# EAGLE design Control_Board_V2 (EAGLE 9.5.2)
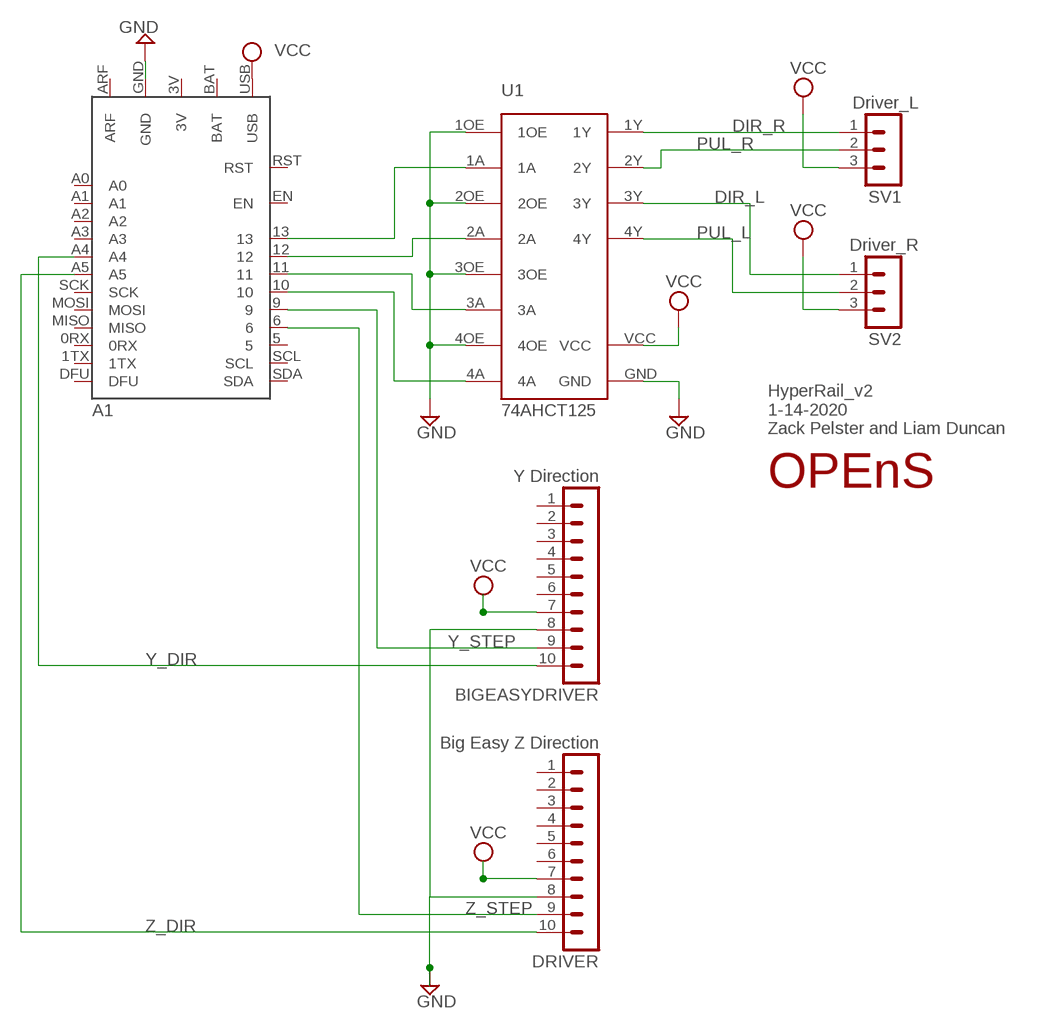
[diagram p0: schematic, sheet 1]

## Parts
A1  FEATHER_BLUEFRUIT_M0  [FEATHER_BLUEFRUIT_M0]
BIGEASYDRIVER  Y Direction  MA10-1  [MA10-1]
DRIVER  Big Easy Z Direction  MA10-1  [MA10-1]
SV1  Driver_L  MA03-1  [MA03-1]
SV2  Driver_R  MA03-1  [MA03-1]
U1  74AHCT125  [74AHCT125]
U$1  OPENS-LOGO  [OPENS-LOGO]

## Nets
DIR_L: SV2.1 U1.3Y
DIR_R: SV1.1 U1.1Y
GND: A1.GND BIGEASYDRIVER.8 DRIVER.8 U1.1OE U1.2OE U1.3OE U1.4OE U1.GND
N$2: A1.13 U1.1A
N$3: A1.12 U1.2A
N$4: A1.11 U1.3A
N$5: A1.10 U1.4A
PUL_L: SV2.2 U1.4Y
PUL_R: SV1.2 U1.2Y
VCC: A1.USB BIGEASYDRIVER.7 DRIVER.7 SV1.3 SV2.3 U1.VCC
Y_DIR: A1.A4 BIGEASYDRIVER.10
Y_STEP: A1.9 BIGEASYDRIVER.9
Z_DIR: A1.A5 DRIVER.10
Z_STEP: A1.6 DRIVER.9
Unconnected: A1.0RX A1.1TX A1.5 A1.A0 A1.A1 A1.A2 A1.A3 A1.ARF A1.DFU A1.EN A1.MISO A1.MOSI A1.RST A1.SCK A1.SCL A1.SDA BIGEASYDRIVER.1 BIGEASYDRIVER.2 BIGEASYDRIVER.3 BIGEASYDRIVER.4 BIGEASYDRIVER.5 BIGEASYDRIVER.6 DRIVER.1 DRIVER.2 DRIVER.3 DRIVER.4 DRIVER.5 DRIVER.6

## Notes on the sheet
- HyperRail_v2
  1-14-2020
  Zack Pelster and Liam Duncan

## Power pins joined to a net without a drawn wire
3V: A1.3V
BAT: A1.BAT

## Library data of the parts
A1 = Feather Bluefruit M0:FEATHER_BLUEFRUIT_M0
BIGEASYDRIVER DRIVER = con-lstb:MA10-1: PIN HEADER; OC_FARNELL: unknown; OC_NEWARK: unknown
SV1 SV2 = con-lstb:MA03-1: PIN HEADER; OC_FARNELL: unknown; OC_NEWARK: unknown
U1 = HyperRail:74AHCT125
U$1 = opens-logo:OPENS-LOGO: OPENS Lab Logo

## Board
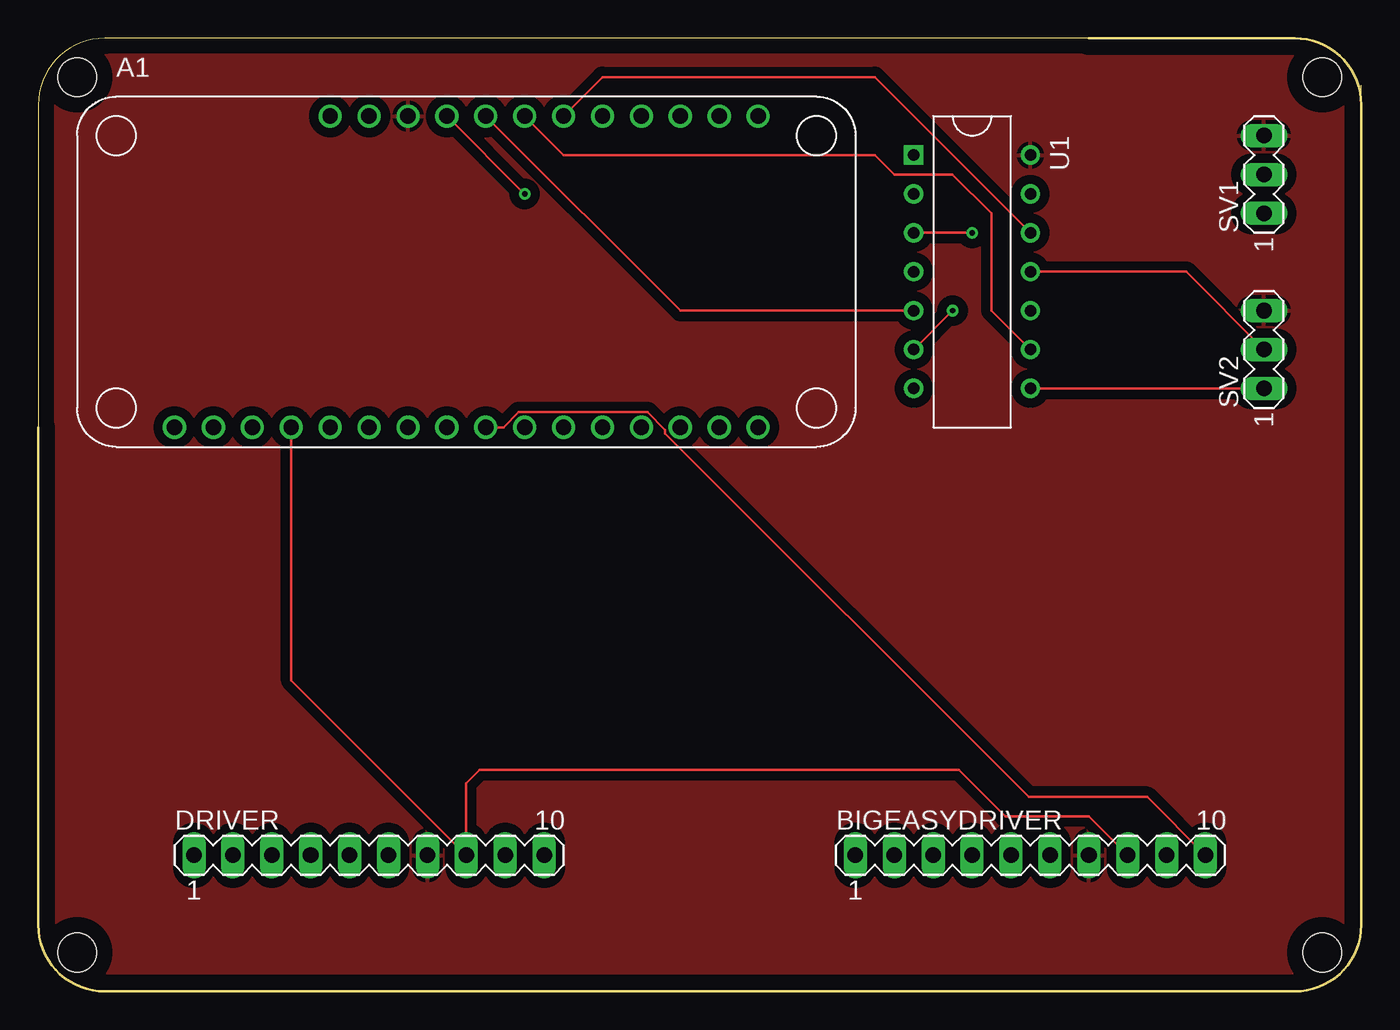
[diagram p1: board, top side]
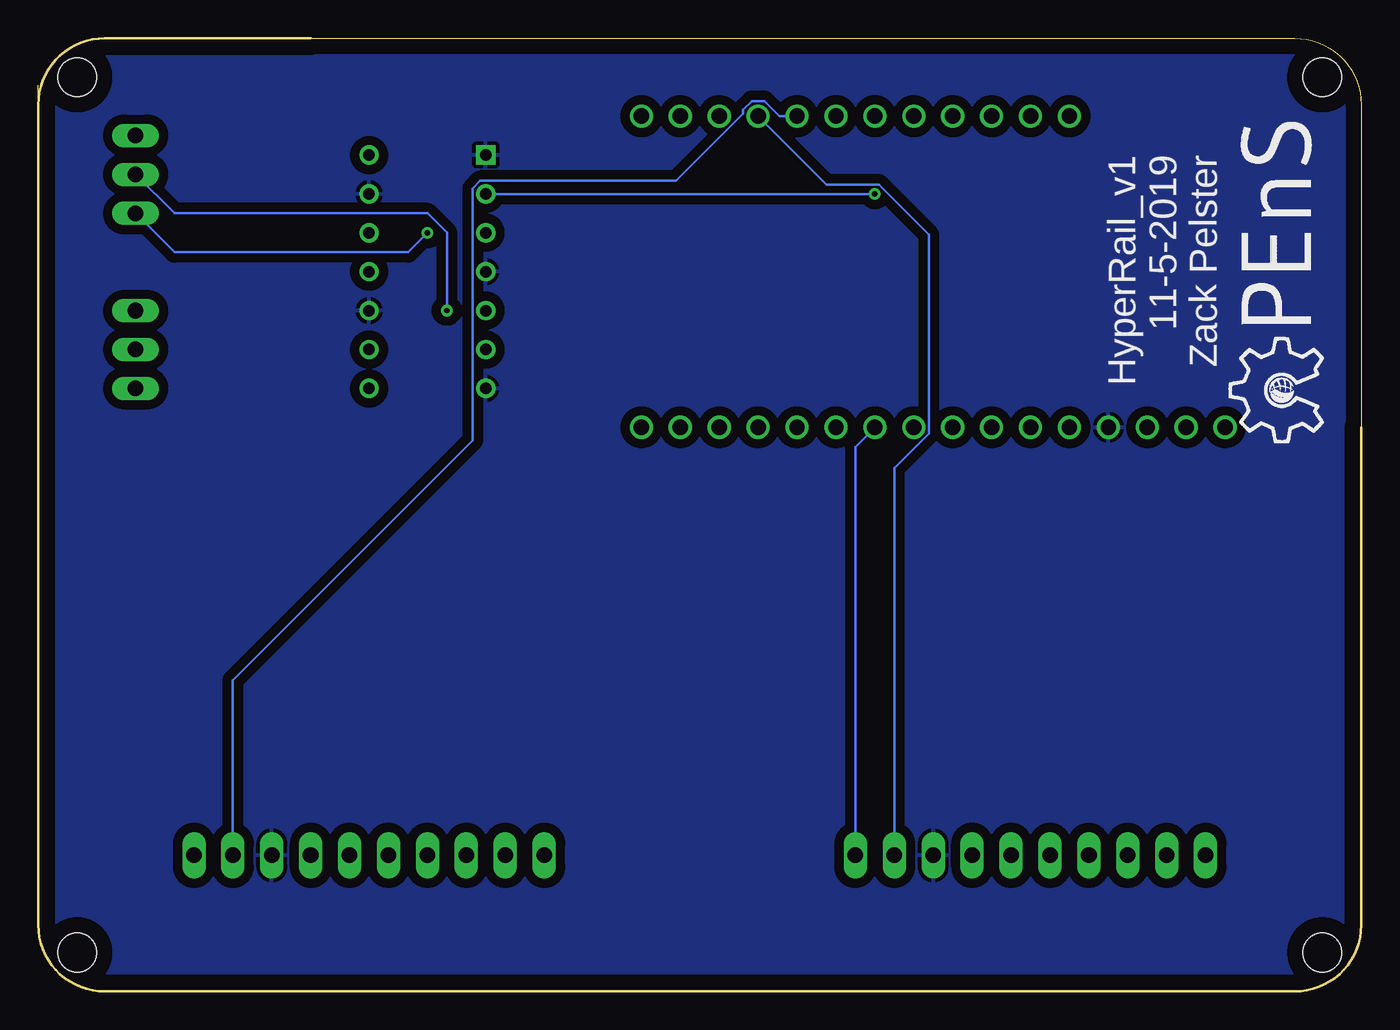
[diagram p2: board, bottom side, seen from below]

Size 86.36 x 62.23 mm. Coordinates in mm from the lower left corner, seen from the top.
Outline: 86.34,37.32 86.36,59.17
Outline: 69.33,62.23 68.58,62.23
Outline: 68.58,62.23 4.34,62.23 arc90 0,57.89 0,36.83
Outline: 0,36.83 0,36.09
Outline: 0,36.83 0,4.34 arc90 4.34,0 82.02,0 arc90 86.36,4.34 86.36,57.89 arc90 82.02,62.23 68.58,62.23
Copper layers (1*16): Top 0.035mm / dielectric 1.5mm / Bottom 0.035mm
Design rules "default": minimum track width 6mil, minimum drill 0.35mm, track to track 6mil, track to pad 6mil, pad to pad 6mil, via to via 6mil, smd to smd 6mil, copper to edge 40mil, drill to drill 6mil, minimum pad ring 10mil, minimum via ring 8mil, stop-mask expansion 4mil, vias tented up to drill 0mil, thermal gap 10mil
Holes 2.54 mm at 2.54,2.54 2.54,59.69 83.82,59.69 83.82,2.54

### Footprints (pad centres in the part's own frame; a part is rotated, then mirrored left to right if it is on the bottom)
FEATHER_BLUEFRUIT_M0 = drill 1: 0RX 39.37,1.27; 1TX 41.91,1.27; 3V 8.89,1.27; 5 39.37,21.59; 6 36.83,21.59; 9 34.29,21.59; 10 31.75,21.59; 11 29.21,21.59; 12 26.67,21.59; 13 24.13,21.59; A0 16.51,1.27; A1 19.05,1.27; A2 21.59,1.27; A3 24.13,1.27; A4 26.67,1.27; A5 29.21,1.27; ARF 11.43,1.27; BAT 16.51,21.59; DFU 44.45,1.27; EN 19.05,21.59; GND 13.97,1.27; MISO 36.83,1.27; MOSI 34.29,1.27; RST 6.35,1.27; SCK 31.75,1.27; SCL 41.91,21.59; SDA 44.45,21.59; USB 21.59,21.59
MA10-1 = drill 1.016 long: 1 -11.43,0; 2 -8.89,0; 3 -6.35,0; 4 -3.81,0; 5 -1.27,0; 6 1.27,0; 7 3.81,0; 8 6.35,0; 9 8.89,0; 10 11.43,0
MA03-1 = drill 1.016 long: 1 -2.54,0; 2 0,0; 3 2.54,0
74AHCT125 = drill 0.75: 1A 5.08,0; 1Y 7.62,0; 2A 12.7,0; 2OE 10.16,0; 2Y 15.24,0; 3A 15.24,7.62; 3OE 12.7,7.62; 3Y 17.78,7.62; 4A 7.62,7.62; 4OE 5.08,7.62; 4Y 10.16,7.62; GND 17.78,0; VCC 2.54,7.62 | drill 0.75 square: 1OE 2.54,0

### Placement (x,y rotation side)
A1  2.54,35.56 0 top
BIGEASYDRIVER  64.77,8.89 0 top
DRIVER  21.59,8.89 0 top
SV1  80.01,53.34 90 top
SV2  80.01,41.91 90 top
U1  57.15,57.15 270 top
U$1  -1.27,35.56 90 bottom

### Tracks (layer width: path | path; a pad name or v marks a point on that pad's centre or on a via)
DIR_L
  Top 0.152: U1.3Y SV2.1
DIR_R  (via drill 0.35)
  Top 0.152: U1.1Y v60.96,49.53
  Bottom 0.152: v60.96,49.53 62.23,48.26 77.47,48.26 SV1.1
GND
  Top 0.152: A1.GND 16.51,20.32 DRIVER.8 27.94,13.59 28.8,14.45 60.1,14.45 63.12,11.43 68.58,11.43 BIGEASYDRIVER.8
  pour Bottom (isolate 0.61): 86.36,0 86.36,62.23 0,62.23 0,0
N$2  (via drill 0.35)
  Top 0.152: A1.13 v31.75,52.07
  Bottom 0.152: v31.75,52.07 U1.1A
N$3
  Top 0.152: A1.12 41.91,44.45 U1.2A
N$4
  Top 0.152: A1.11 34.29,54.61 54.61,54.61 55.88,53.34 59.69,53.34 62.23,50.8 62.23,44.45 U1.3A
N$5
  Top 0.152: A1.10 36.83,59.69 54.61,59.69 U1.4A
PUL_L
  Top 0.152: U1.4Y 74.93,46.99 SV2.2
PUL_R  (via drill 0.35)
  Top 0.152: U1.2Y v59.69,44.45
  Bottom 0.152: v59.69,44.45 59.69,49.53 60.96,50.8 77.47,50.8 SV1.2
VCC
  pour Top (isolate 0.61): 86.36,62.23 86.36,0 0,0 0,62.23
  pour Top (isolate 0.61): 86.36,62.23 86.36,0 0,0 0,62.23
  pour Top (isolate 0.61): 86.36,62.23 86.36,0 0,0 0,62.23
Y_DIR
  Top 0.152: BIGEASYDRIVER.10 72.39,12.7 64.65,12.7 40.93,36.42 40.93,36.66 39.78,37.81 31.34,37.81 30.36,36.83 A1.A4
Y_STEP
  Bottom 0.152: BIGEASYDRIVER.9 73.66,20.32 58.01,35.97 58.01,52.42 57.51,52.93 44.74,52.93 40.35,57.32 40.35,57.56 39.78,58.13 38.96,58.13 37.98,57.15 A1.9
Z_DIR
  Bottom 0.152: A1.A5 33.02,35.56 DRIVER.10
Z_STEP
  Bottom 0.152: DRIVER.9 30.48,34.17 28.23,36.42 28.23,49.41 31.5,52.68 34.9,52.68 A1.6

### Text on the board
bPlace: HyperRail_v1 / 11-5-2019 / Zack Pelster